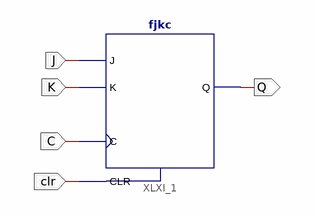
[diagram p0: schematic sheet 1]
// Xilinx ISE schematic scheme.sch (virtex5) as structural Verilog: 1 symbols, 5 ports
module scheme (
  input  J,
  input  K,
  input  C,
  input  clr,
  output Q
);

  fjkc XLXI_1 (.C(C), .CLR(clr), .J(J), .K(K), .Q(Q));
endmodule
